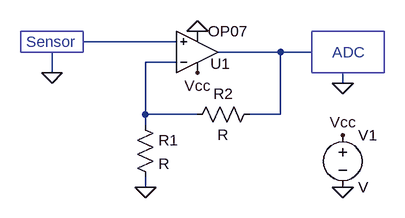
[diagram p0: schematic Draft1.asc]
Draft1.asc, the LTspice schematic file:
Version 4
SHEET 1 880 680
WIRE 128 128 -16 128
WIRE 288 144 192 144
WIRE 336 144 288 144
WIRE 128 160 80 160
WIRE -64 176 -64 144
WIRE 384 192 384 176
WIRE 80 240 80 160
WIRE 160 240 80 240
WIRE 288 240 288 144
WIRE 288 240 240 240
WIRE 80 256 80 240
WIRE 80 352 80 336
FLAG 384 192 0
FLAG -64 176 0
FLAG 80 352 0
FLAG 384 352 0
FLAG 384 272 Vcc
FLAG 160 112 0
FLAG 160 176 Vcc
SYMBOL OpAmps\\OP07 160 208 M180
WINDOW 0 20 46 Left 2
SYMATTR InstName U1
SYMBOL res 64 240 R0
SYMATTR InstName R1
SYMBOL res 256 224 R90
WINDOW 0 0 56 VBottom 2
WINDOW 3 32 56 VTop 2
SYMATTR InstName R2
SYMBOL voltage 384 256 R0
SYMATTR InstName V1
TEXT -104 128 Left 2 ;Sensor
TEXT 368 144 Left 2 ;ADC
RECTANGLE Normal -16 144 -112 112
RECTANGLE Normal 448 176 336 112

The netlist it stands for:
* Draft1.asc
XU1 N001 N003 Vcc 0 N002 LT1001  ; OP07, pins In+ In- V+ V- OUT
R1 N003 0 R
R2 N002 N003 R
V1 Vcc 0 V
* Sensor
* ADC
.lib LTC.lib
.backanno
.end